# Altium project IR Sensor.PrjPcb
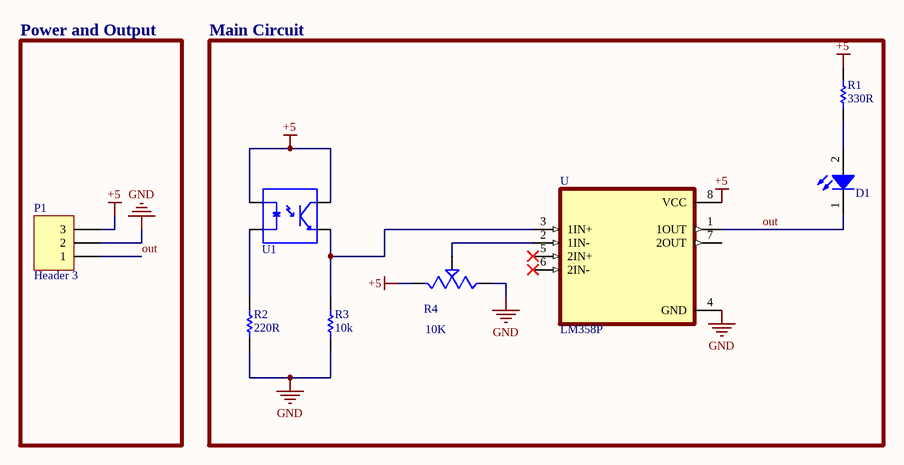
[diagram p0: Sheet1.SchDoc]
1 sheet, 8 parts. Net scope: global (net labels, ports and power ports of the same name join across sheets).
Board file: PCB1.PcbDoc

## Sheet Sheet1.SchDoc
size A; SheetNumber: 1; SheetTotal: 1

### Parts
D1  15400385A3590  [WL-TIRW_D3.9H5.3]  (value not drawn)
P1  Header 3  [HDR1X3]
R1  330R  [AXIAL-0.3]
R2  220R  [AXIAL-0.3]
R3  10k  [AXIAL-0.3]
R4  10K  [TRIM_EVN-D8AA03B14]
U  LM358P  [DIP794W45P254L959H508Q8]
U1  TCRT5000  [OPTO_TCRT5000]  (value not drawn)

### Blocks framed on the sheet
Power and Output: P1
Main Circuit: D1 R1-R4 U U1

### Nets
+5: P1.3 R1.2 R4.3 U.8(VCC) U1.A U1.COLL
GND: P1.2 R2.1 R3.1 R4.1 U.4(GND)
out: D1.1(K) P1.1 U.1(1OUT)
NetD1_2: D1.2(A) R1.1
NetR2_2: R2.2 U1.CATH
NetR3_2: R3.2 U.3(1IN+) U1.E
NetR4_2: R4.2 U.2(1IN-)

Not connected (* = marked no-connect by the designer): U 5(2IN+)* 6(2IN-)* 7(2OUT)

### Library data of the parts
D1 = 15400385A3590: WL-TIRW THT Infrared Round Waterclear, D3.9H5.3, 60mW/sr, 1.5V, 35deg; Manufacturer: Wurth Elektronik; Peak Wavelength: 850nm; Chip Technology: AlGaAs; Centroid Wavelength: 845nm; ComponentLink1Description: Manufacturer; ComponentLink1URL: http://www.we-online.de; ComponentLink2Description: Datasheet; ComponentLink2URL: https://www.we-online.com/catalog/datasheet/15400385A3590.pdf; Operating Temperature: -40 to +85degC; Emitting Color: Infrared; Forward Voltage: 1.5V; Manufacturer Part Number: 15400385A3590; Packaging: Bulk; Mounting Technology: THT; Published Date: August 2020; Radiant Intensity typ.: 60mW/sr; Size: D3.9H5.3; Viewing Angle: 35deg
P1 = Header 3: Header, 3-Pin; LatestRevisionDate: 17-Jul-2002; LatestRevisionNote: Re-released for DXP Platform.; Publisher: Altium Limited
R1-R3 = Res1: Resistor; Published: 8-Jun-2000; LatestRevisionDate: 17-Jul-2002; LatestRevisionNote: Re-released for DXP Platform.; PackageReference: AXIAL-0.3; Publisher: Altium Limited; PackageDescription: Axial Device, Thru-Hole; 2 Leads; 0.3 in Pin Spacing
R4 = EVN-D8AA03B14: 10 kOhms 0.1W, 1/10W PC Pins Through Hole Trimmer Potentiometer Carbon 1 Turn Top Adjustment; MF: Panasonic Electronic; Price: None; MP: EVN-D8AA03B14; Package: PQFP-44 Panasonic; Value: *; Availability: Unavailable; SnapEDA_Link: https://www.snapeda.com/parts/EVN-D8AA03B14/Panasonic%20Electronic%20Components/view-part/1534925/?ref=snap
U = LM358P: Dual Operational Amplifiers; MF: Texas Instruments; Package: PDIP-8 Texas Instruments; DigiKey-Purchase-URL: https://snapeda.com/shop?store=DigiKey&id=559457; MP: LM358P; Arrow_Electronics-Purchase-URL: https://snapeda.com/shop?store=Arrow+Electronics&id=559457; Price: None; Texas_Instruments-Purchase-URL: https://snapeda.com/shop?store=Texas+Instruments&id=559457; Value: *; Availability: Unavailable; SnapEDA_Link: https://www.snapeda.com/parts/LM358P/Texas%20Instruments/view-part/559457/?ref=snap; Mouser-Purchase-URL: https://snapeda.com/shop?store=Mouser&id=559457
U1 = TCRT5000: Reflective Optical Sensor 0.591 _15mm_ PCB Mount; MF: Vishay; Package: PCB Mount Vishay; Value: *; Price: None; MP: TCRT5000; SnapEDA_Link: https://www.snapeda.com/parts/TCRT5000/Vishay%20Semiconductor%20Opto%20Division/view-part/885229/?ref=snap; Availability: Unavailable